# Altium schematic sheet 5V_regulator_V3.SchDoc
size B; SheetNumber: 8; SheetTotal: 8
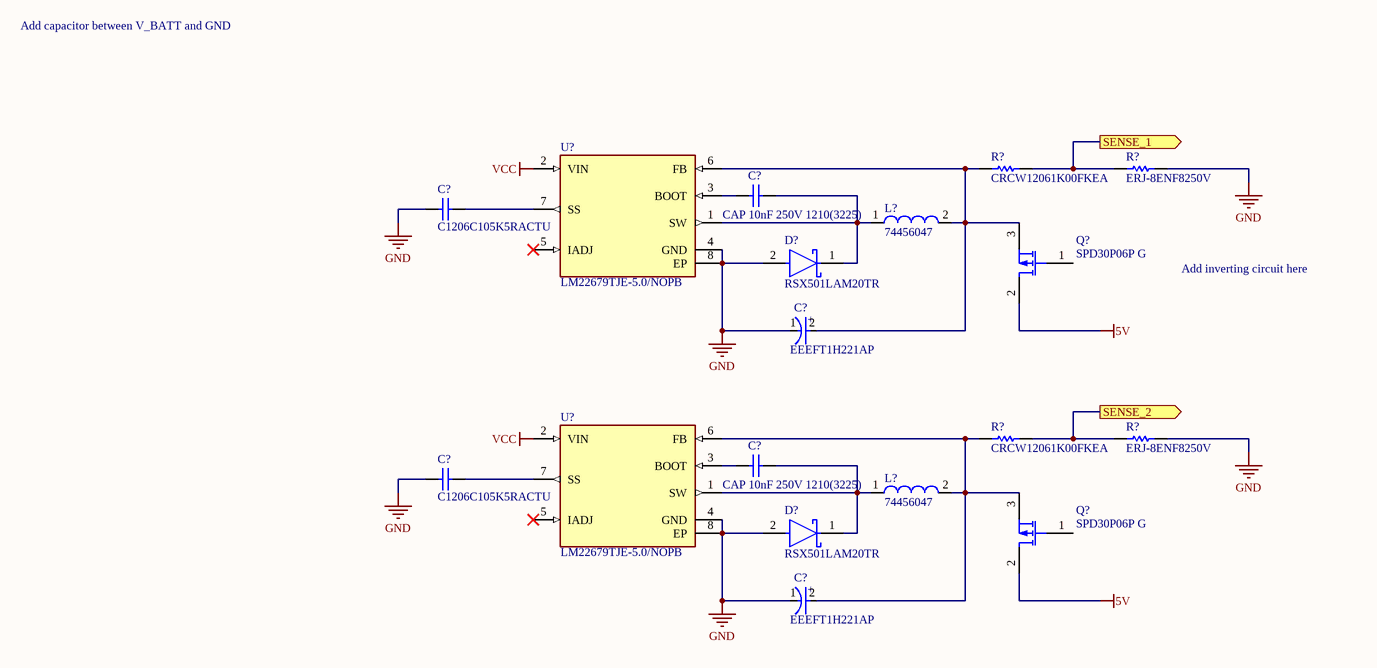
[diagram p0: 5V_regulator_V3.SchDoc]

## Parts
(Parts that share a designator on the sheet are numbered #1, #2 ... from top to bottom, then left to right.)
C?#1  CAP 10nF 250V 1210(3225)  [CAPC1210(3225)100_N]
C?#2  C1206C105K5RACTU  [CAPC3216X110X50LL20T25]
C?#3  EEEFT1H221AP  [FP-FTF-MFG]
C?#4  CAP 10nF 250V 1210(3225)  [CAPC1210(3225)100_N]
C?#5  C1206C105K5RACTU  [CAPC3216X110X50LL20T25]
C?#6  EEEFT1H221AP  [FP-FTF-MFG]
D?#1  RSX501LAM20TR  [FP-PMDTM-MFG]
D?#2  RSX501LAM20TR  [FP-PMDTM-MFG]
L?#1  74456047  [WE-PD4-L]
L?#2  74456047  [WE-PD4-L]
Q?#1  SPD30P06P G  [INF-PG-TO252-3-1_N]
Q?#2  SPD30P06P G  [INF-PG-TO252-3-1_N]
R?#1  ERJ-8ENF8250V  [RESC3216X70X50LL05T20]
R?#2  CRCW12061K00FKEA  [RESC3216X60X45ML15T20]
R?#3  ERJ-8ENF8250V  [RESC3216X70X50LL05T20]
R?#4  CRCW12061K00FKEA  [RESC3216X60X45ML15T20]
U?#1  LM22679TJE-5.0/NOPB  [FP-NDR0007A-MFG]
U?#2  LM22679TJE-5.0/NOPB  [FP-NDR0007A-MFG]

## Ports
SENSE_1 (out), SENSE_2 (out)

## Nets
5V: Q?#1.2(D) Q?#2.2(D)
GND: C?#2.1 C?#3.1(C) C?#5.1 C?#6.1(C) D?#1.2(A) D?#2.2(A) R?#1.2 R?#3.2 U?#1.4(GND) U?#1.8(EP) U?#2.4(GND) U?#2.8(EP)
VCC: U?#1.2(VIN) U?#2.2(VIN)
SENSE_1: R?#1.1 R?#2.2 ; port SENSE_1
SENSE_2: R?#3.1 R?#4.2 ; port SENSE_2
NetC?#1_1: C?#1.1 U?#1.3(BOOT)
NetC?#1_2: C?#1.2 D?#1.1(C) L?#1.1 U?#1.1(SW)
NetC?#2_2: C?#2.2 U?#1.7(SS)
NetC?#3_2: C?#3.2(A) L?#1.2 Q?#1.3(S) R?#2.1 U?#1.6(FB)
NetC?#4_1: C?#4.1 U?#2.3(BOOT)
NetC?#4_2: C?#4.2 D?#2.1(C) L?#2.1 U?#2.1(SW)
NetC?#5_2: C?#5.2 U?#2.7(SS)
NetC?#6_2: C?#6.2(A) L?#2.2 Q?#2.3(S) R?#4.1 U?#2.6(FB)

Not connected (* = marked no-connect by the designer): Q?#1 1(G); Q?#2 1(G); U?#1 5(IADJ)*; U?#2 5(IADJ)*

## Notes on the sheet
- Add capacitor between V_BATT and GND
- Add inverting circuit here
- (in symbol CMP-05427-000092-1) +

## Library data of the parts
C?#1 C?#4 = CMP-1038-01142-1: CAP 10nF 250V ±10% 1210 (3225 Metric) Thickness 1mm SMD; Case-EIA: 1210; Case-Metric: 3225; Tolerance: Â±10%; Rated Voltage: 250 V; Max Thickness: 1 mm; Value: 10nF; Technology: SMT
C?#2 C?#5 = CMP-2000-06011-1: Chip Capacitor, 1 uF, +/- 10%, 50 V, -55 to 125 degC, 1206 (3216 Metric), RoHS, Tape and Reel; Manufacturer: Kemet; Case Height: 1mm; Dielectric: X7R; Voltage Rating: 50V; Capacitance: 1uF; Temperature Coefficient / Code: +/-15%; Case Length: 3.2mm; Case Width: 1.6mm; Type: SMDMLCCX7R6.3-250VDCCommericalGrade; Class: Class1; Capacitance - nF: 1000nF; Datasheet URL: http://www.kemet.com/docfinder?Partnumber=C1206C105K5RACTU; Product Category: MultilayerCeramicCapacitorsMLCC-SMD/SMT; Termination Style: SMD/SMT; Dimensions: 1.6mmWx3.2mmLx1mmH; Voltage Rating DC: 50V; Datasheet Version: 02/2016; Packaging: Reel; Brand: Kemet; RoHS: Details; Minimum Operating Temperature: -55C; Operating Temperature Range: -55Cto+125C; Package Reference: 1206; Manufacturer URL: http://www.kemet.com/; Product: GeneralTypeMLCCs; Tolerance: 10%; Package Description: 2-Pin Surface Mount Device, Body 3.2 x 1.6 mm; Mounting Technology: SurfaceMount; Case Code - mm: 3216; Maximum Operating Temperature: +125C; Series: C1206C; Factory Pack Quantity: 2500; Package / Case: 1206(3216metric); Case Code - in: 1206
C?#3 C?#6 = CMP-05427-000092-1: CAP ALUM 220UF 20% 50V SMD; Ripple Current (AC): 670mA; Dielectric Material: Aluminium; Life (Hours): 2000Hour; Leakage Current: 110uA; Lead Diameter: 0.9mm; ESR (Equivalent Series Resistance): 180mR; REACH SVHC: No SVHC; Voltage Rating (DC): 50V; Radiation Hardening: No; Capacitance: 220uF; Length: 10.2mm; Construction: Cylindrical; Case/Package: Radial; Series: FT; Lead Free: Lead Free; Voltage Rating: 50V; Tolerance: 20%; Contact Plating: Tin; Number of Pins: 2; Height - Seated (Max): 0.413inch; RoHS Compliant: Yes; Diameter: 8mm; Ripple Current: 670mA; Lead Pitch: 3.1mm; Termination: SMD/SMT; Mount: Surface Mount; Min Operating Temperature: -55°C; Max Operating Temperature: 105°C; Voltage: 50V; Height: 10.2mm; Package Quantity: 500; Packaging: Tape and Reel
D?#1 D?#2 = CMP-08971-000008-1: DIODE SCHOTTKY 20V 5A PMDTM; Manufacturer: Rohm; Max Surge Forward Current: 100A; Max Junction Temp: +125°C; Max Repetitive Reverse Voltage: 25V; Peak Reverse Current: 500uA; Automotive: No; Digikey Description: DIODE SCHOTTKY 20V 5A PMDTM; Temperature Range High: +125°C; Height: 1.05mm; Octopart: https://octopart.com/rsx501lam20tr-rohm-82270774; Lead Free: Yes; ComponentLink2URL: https://fscdn.rohm.com/en/products/databook/datasheet/discrete/diode/schottky_barrier/rsx501lam20tr-e.pdf; Device Class L2: Diodes; ComponentLink2Description: Datasheet; Device Class L1: Discrete Semiconductors; RoHS: TRUE; Reverse Voltage: 20V; Package: PMDTM; Category: Diode; Temperature: to +125°C; Device Class L3: Schottky Diodes; Manufacturer Part Number: RSX501LAM20TR; Forward Current: 5A
L?#1 L?#2 = CMP-0227-00798-1: SMD-Power Inductor WE-PD4, L = 4.70 µH; Inductance: 4.70 ÂµH; PackageReference: WE-PD4-L; ComponentLink2Description: Datasheet; ComponentLink1URL: http://www.we-online.com; DatasheetVersion: ver 2, Sep-2006; ComponentLink2URL: http://www.we-online.de/katalog/media/pdf/74456047.pdf; PackageVersion: 2006; PackageDescription: SMD Inductor, 2-Leads, Body 12.7 x 10.0 mm; ComponentLink1Description: Manufacturer Link
Q?#1 Q?#2 = CMP-1099-00058-1: P-Channel SIPMOS Power-Transistor, -60 V VDS, -30 A ID, -55 to 175 degC, PG-TO252-3-1, Reel, Green; Manufacturer: Infineon; Pto t (max): 125Â W; RDS (on) (max): 75Â mOhm; VGS(th) (max): -4Â V; Green: TRUE; ID (max): -30Â A; QG: 32Â nC; VDS (max): -60Â V; VGS(th) (min): -2.1Â V; RthJC (max): 1.2Â K/W; IDpuls (max): -120Â A; ComponentLink1Description: Manufacturer URL; Packing: Reel; ComponentLink2Description: Datasheet; ComponentLink1URL: http://www.infineon.com/; ComponentLink3Description: Package Specification; PackageDescription: 3-Pin Plastic (Green) Transistor Single Outline Package, 6.5 x 6.12 mm Body, 2.28 mm Pitch; Mounting Technology: Surface Mount; ComponentLink3URL: http://www.infineon.com/dgdl/TLE42744_DS_11.pdf?folderId=db3a304318f3fe290118f5a433570040&fileId=db3a304327b897500128012ccafe37d2&sId=db3a30443d67b5ca013d83f7c0ea327b; Rth: 1.2Â K/W; ComponentLink2URL: http://www.infineon.com/dgdl/SPD30P06P_Rev.2.3_pdf.pdf?folderId=db3a30431ed1d7b2011f4042f2ff4ec5&fileId=db3a30431ed1d7b2011f404fbc7e4ef4; PartNumber: SPD30P06P G; PackageReference: PG-TO252-3-1; DatasheetVersion: Rev. 2.3; PackageVersion: Jan-10
R?#1 R?#3 = CMP-2003-00507-1: Manufacturer: Panasonic; Part Number: ERJ-8ENF8250V
R?#2 R?#4 = CMP-2100-03616-1: Chip Resistor, 1 KOhm, +/- 1%, 0.25 W, -55 to 155 degC, 1206 (3216 Metric), RoHS, Tape and Reel; Manufacturer: Vishay Semiconductor; Power Rating: 250mW; Voltage Rating (DC): 200V; Resistance: 1KOhm; Temperature Coefficient: 100ppm/degreesC; Case Code (Imperial): 1206; Length: 3.2mm; Case/Package: 1206; Contact Plating: Tin; Package Quantity: 10; Datasheet URL: http://www.farnell.com/datasheets/1720486.pdf; Mount: SurfaceMount; Package Description: 2-Pin Surface Mount Device, Body 3.15 x 1.6 mm; Package Reference: 1206.0; Max Operating Temperature: 155degC; Lead Free: LeadFree; Weight: 0.000353oz; Military Standard: Not; Max Power Dissipation: 250mW; Case Code (Metric): 3216; Number of Terminations: 2; Tolerance: 1%; Width: 0.063inch; Termination: SMD/SMT; Number of Pins: 2; Min Operating Temperature: -55degC; Height: 0.55mm; Depth: 1.6mm; RoHSCompliant: true; Composition: ThickFilm; Packaging: TapeandReel; Manufacturer URL: http://www.vishay.com/; Voltage Rating: 200V; Radiation Hardening: No; REACH SVHC: Unknown; Datasheet Version: 41061.0
U?#1 U?#2 = CMP-0069-00304-3: IC REG BUCK 5V 5A TO263-7; Efficiency: 90%; Number of Outputs: 1; Max Input Voltage: 42V; Min Input Voltage: 4.5V; Frequency: 500kHz; Min Supply Voltage: 8V; Output Type: Fixed; Quiescent Current: 3.4mA; Synchronous Rectifier: No; Output Current: 5A; Number of Pins: 7; REACH SVHC: No SVHC; Contact Plating: Tin; Max Operating Temperature: 125°C; Series: SIMPLE SWITCHER®; RoHS Compliant: Yes; Case/Package: TO-263; Max Supply Voltage: 42V; Output Voltage: 5V; Max Output Current: 5A; Height: 2mm; Package Quantity: 250; Max Output Voltage: 5V; Radiation Hardening: No; Width: 9.85mm; Mount: Surface Mount; Length: 10.16mm; Packaging: Cut Tape; Min Operating Temperature: -40°C; Switching Frequency: 500kHz; Termination: SMD/SMT; Nominal Output Voltage: 5V; Lead Free: Lead Free